# EAGLE design Electronical_dice (EAGLE 9.6.2)
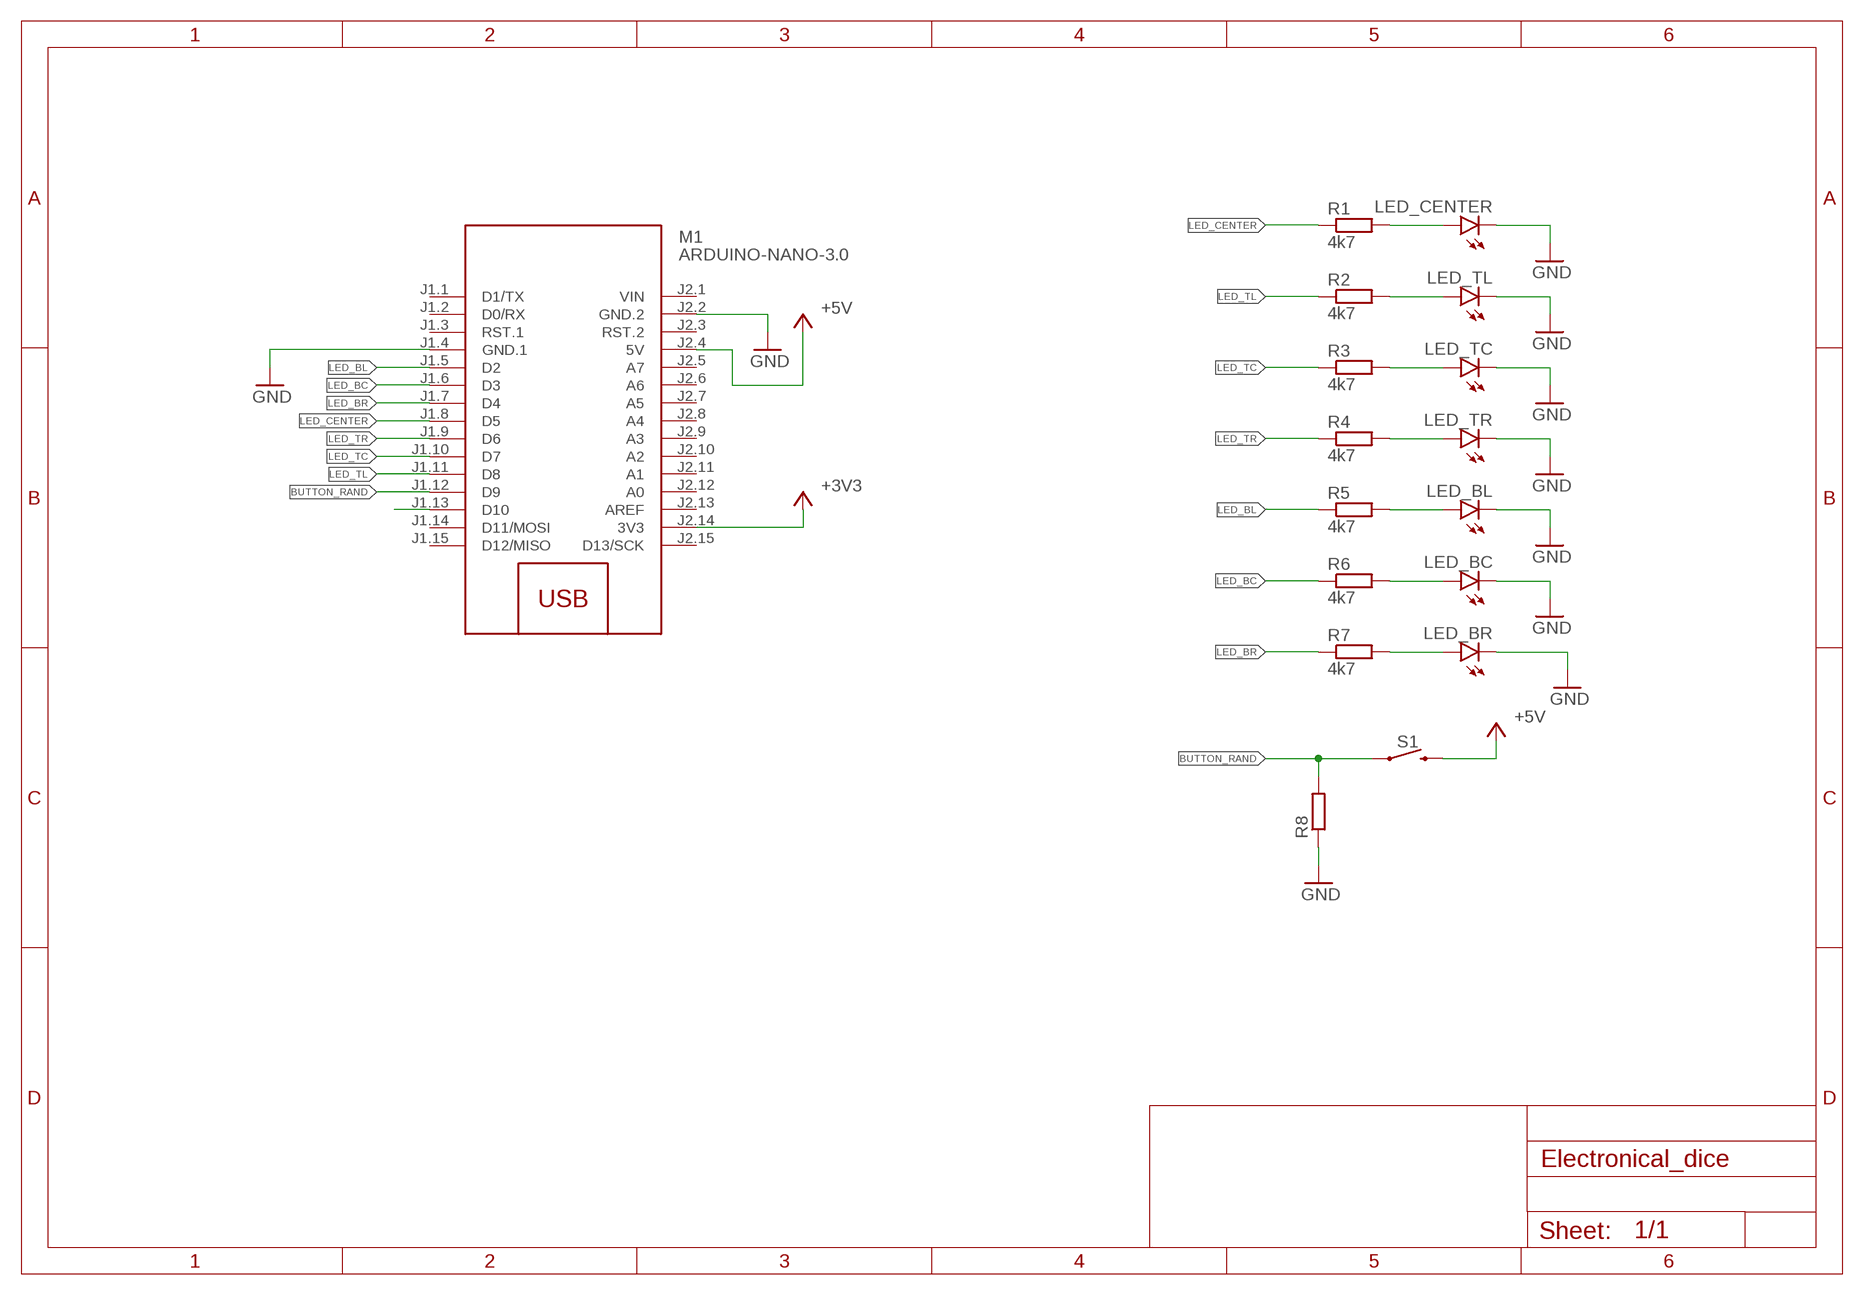
[diagram p0: schematic, sheet 1]

## Parts
LED_BC  LED_RADIAL_RED  [LEDRD254W60D565H860B]
LED_BL  LED_RADIAL_RED  [LEDRD254W60D565H860B]
LED_BR  LED_RADIAL_RED  [LEDRD254W60D565H860B]
LED_CENTER  LED_RADIAL_RED  [LEDRD254W60D565H860B]
LED_TC  LED_RADIAL_RED  [LEDRD254W60D565H860B]
LED_TL  LED_RADIAL_RED  [LEDRD254W60D565H860B]
LED_TR  LED_RADIAL_RED  [LEDRD254W60D565H860B]
M1  ARDUINO-NANO-3.0  [ARDUINO-NANO-3.0]
R1  4k7  R-EU_0207/7  [0207/7]
R2  4k7  R-EU_0207/7  [0207/7]
R3  4k7  R-EU_0207/7  [0207/7]
R4  4k7  R-EU_0207/7  [0207/7]
R5  4k7  R-EU_0207/7  [0207/7]
R6  4k7  R-EU_0207/7  [0207/7]
R7  4k7  R-EU_0207/7  [0207/7]
R8  R-EU_0207/7  [0207/7]
S1  MOMENTARY-SWITCH-SPST-PTH-6.0MM  [TACTILE_SWITCH_PTH_6.0MM]

## Nets
+3V3: M1.J2.14(3V3)
+5V: M1.J2.4(5V) S1.3
BUTTON_RAND: M1.J1.12(D9) R8.2 S1.1
GND: LED_BC.2(C) LED_BL.2(C) LED_BR.2(C) LED_CENTER.2(C) LED_TC.2(C) LED_TL.2(C) LED_TR.2(C) M1.J1.4(GND.1) M1.J2.2(GND.2) R8.1
LED_BC: M1.J1.6(D3) R6.1
LED_BL: M1.J1.5(D2) R5.1
LED_BR: M1.J1.7(D4) R7.1
LED_CENTER: M1.J1.8(D5) R1.1
LED_TC: M1.J1.10(D7) R3.1
LED_TL: M1.J1.11(D8) R2.1
LED_TR: M1.J1.9(D6) R4.1
N$1: LED_CENTER.1(A) R1.2
N$2: LED_TL.1(A) R2.2
N$3: LED_TC.1(A) R3.2
N$4: LED_TR.1(A) R4.2
N$5: LED_BL.1(A) R5.2
N$6: LED_BC.1(A) R6.2
N$7: LED_BR.1(A) R7.2
N$9: M1.J1.13(D10)
Unconnected: M1.J1.1(D1/TX) M1.J1.2(D0/RX) M1.J1.3(RST.1) M1.J1.14(D11/MOSI) M1.J1.15(D12/MISO) M1.J2.3(RST.2) M1.J2.5(A7) M1.J2.6(A6) M1.J2.7(A5) M1.J2.8(A4) M1.J2.9(A3) M1.J2.10(A2) M1.J2.11(A1) M1.J2.12(A0) M1.J2.13(AREF) M1.J2.15(D13/SCK)

## Power pins joined to a net without a drawn wire
VIN: M1.J2.1(VIN)

## Library data of the parts
LED_BC LED_BL LED_BR LED_CENTER LED_TC LED_TL LED_TR = Opto-Electronic:LED_RADIAL: LED - Generic; CATEGORY: Opto-Electronic; SUB-CATEGORY: LED
M1 = diy-modules:ARDUINO-NANO-3.0: Arduino Nano 3.0 and compatible devices More details available here: https://www.arduino.cc/en/Main/ArduinoBoardNano Click here to find device on ebay.com <http://www.ebay.com/sch/arduino+nano>
R1-R8 = rcl:R-EU_: RESISTOR, European symbol; SPICEPREFIX: R
S1 = SparkFun-Switches:MOMENTARY-SWITCH-SPST: Momentary Switch (Pushbutton) - SPST Normally-open (NO) SPST momentary switches (buttons, pushbuttons). Variants PTH-12MM - 12mm square, through-hole Momentary Pushbutton Switch - 12mm Square <https://www.sparkfun.com/products/9190> (COM-09190) PTH-6.0MM, PTH-6.0MM-KIT - 6.0mm square, through-hole Mini Pushbutton Switch <https://www.sparkfun.com/products/97> (COM-00097) KIT package intended for soldering kit's - only one side of pads' copper is exposed. PTH-RIGHT-ANGLE-KIT - Right-angle, through-hole Right Angle Tactile Button <https://www.sparkfun.com/products/10791> - Used on SparkFun BigTime Watch Kit <https://www.sparkfun.com/products/11734> SMD-12MM - 12mm square, surface-mount Tactile Button - SMD (12mm) <https://www.sparkfun.com/products/12993> (COM-12993) Used on SparkFun PicoBoard <https://www.sparkfun.com/products/11888> SMD-4.5MM - 4.5mm Square Trackball Switch Used on SparkFun Blackberry Trackballer Breakout <https://www.sparkfun.com/products/13169> SMD-4.6MMX2.8MM - 4.60mm x 2.80mm, surface mount Used on SparkFun SAMD21 Mini Breakout <https://www.sparkfun.com/products/13664> SMD-5.2MM, SMD-5.2-REDUNDANT - 5.2mm square, surface-mount Mini Pushbutton Switch - SMD <https://www.sparkfun.com/products/8720> (COM-08720) Used on Arduino Pro Mini <https://www.sparkfun.com/products/11114> REDUNDANT package connects both switch circuits together SMD-6.0X3.5MM - 6.0 x 3.5mm, surface mount Momentary Reset Switch SMD <https://www.sparkfun.com/products/8229> (COM-08229) SMD-6.2MM-TALL - 6.2mm square, surface mount Tactile Button - SMD (6mm) <https://www.sparkfun.com/products/12992> Used on SparkFun Digital Sandbox <https://www.sparkfun.com/products/12651> SMD-RIGHT-ANGLE - Right-angle, surface mount Used on SparkFun Block for Intel® Edison - Arduino <https://www.sparkfun.com/products/13036>; PROD_ID: SWCH-08441; SF_SKU: COM-00097

## Board
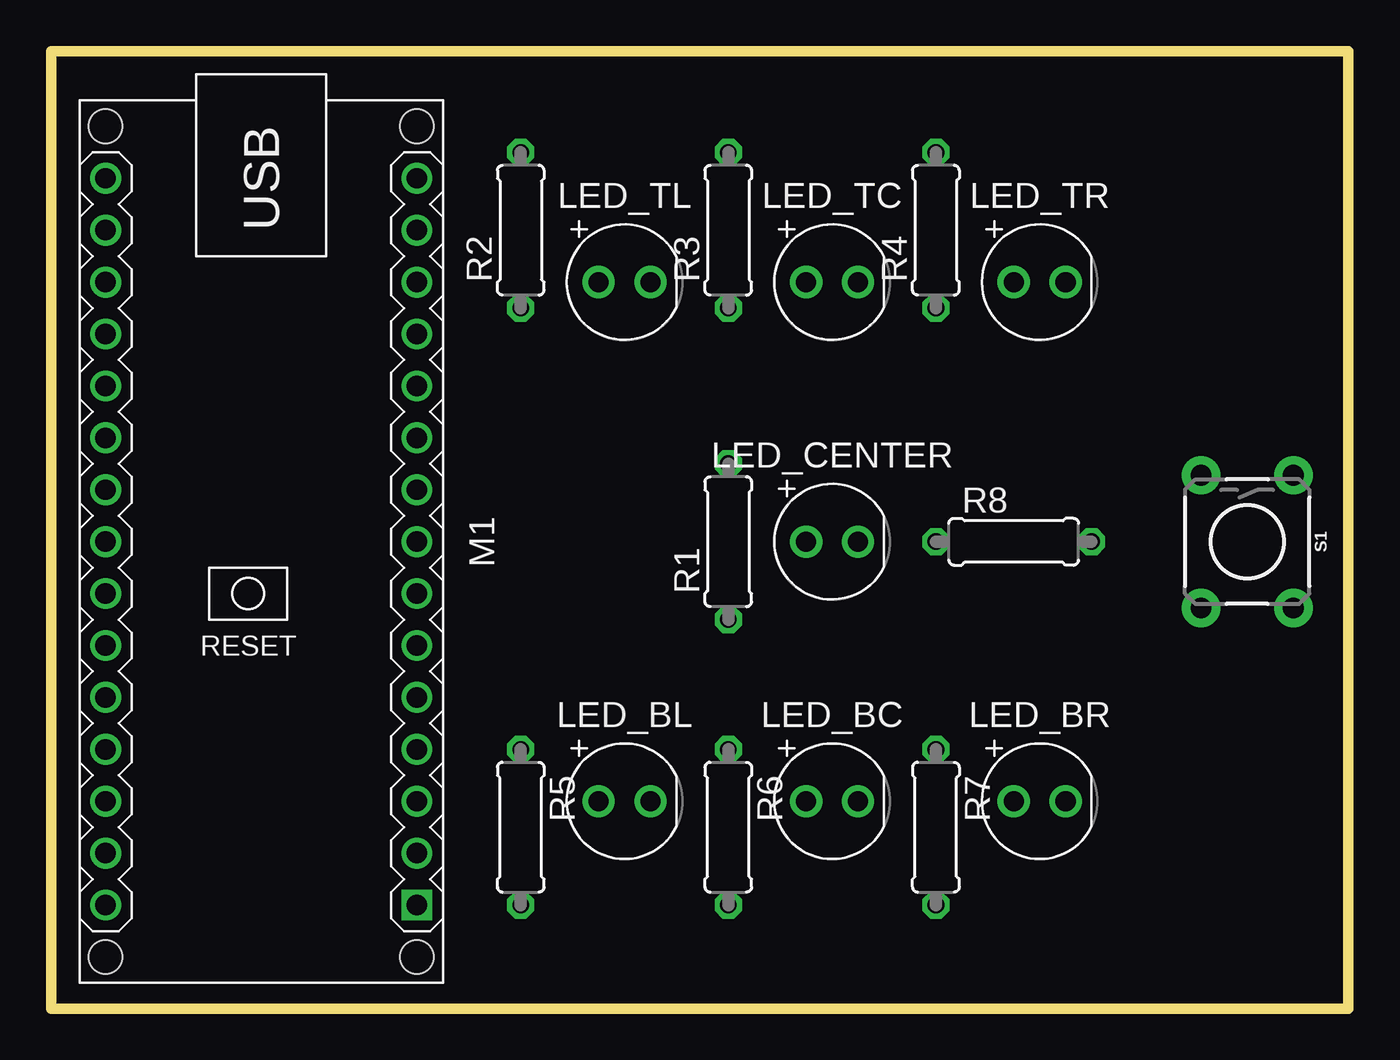
[diagram p1: board, top side]
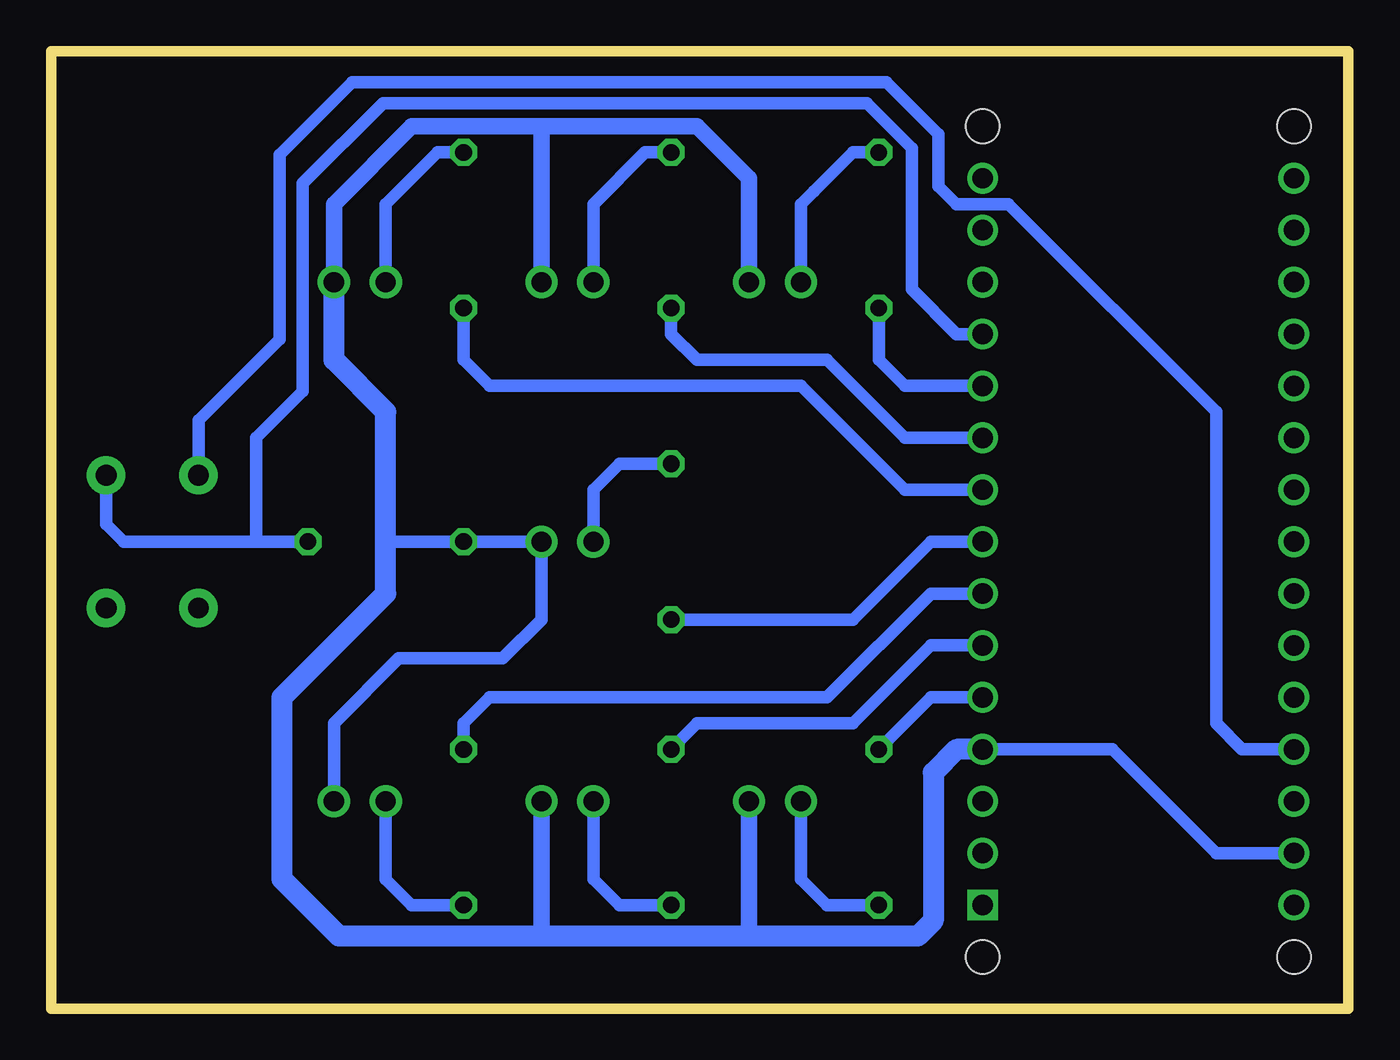
[diagram p2: board, bottom side, seen from below]

Size 63.5 x 46.86 mm. Coordinates in mm from the lower left corner, seen from the top.
Outline: 0,0 63.5,0 63.5,46.86 0,46.86 0,0
Copper layers (1*16): Top 0.035mm / dielectric 1.5mm / Bottom 0.035mm
Design rules "default *": minimum track width 6mil, minimum drill 0.35mm, track to track 6mil, track to pad 6mil, pad to pad 6mil, via to via 6mil, smd to smd 6mil, copper to edge 40mil, drill to drill 6mil, minimum pad ring 10mil, minimum via ring 8mil, stop-mask expansion 4mil, vias tented up to drill 0mil, thermal gap 10mil

### Footprints (pad centres in the part's own frame; a part is rotated, then mirrored left to right if it is on the bottom)
LEDRD254W60D565H860B = drill 0.981 pad 1.581: 1 -1.27,0; 2 1.27,0
ARDUINO-NANO-3.0 = drill 1 square: J1.1 17.78,7.62 | drill 1: J1.2 15.24,7.62; J1.3 12.7,7.62; J1.4 10.16,7.62; J1.5 7.62,7.62; J1.6 5.08,7.62; J1.7 2.54,7.62; J1.8 0,7.62; J1.9 -2.54,7.62; J1.10 -5.08,7.62; J1.11 -7.62,7.62; J1.12 -10.16,7.62; J1.13 -12.7,7.62; J1.14 -15.24,7.62; J1.15 -17.78,7.62; J2.1 17.78,-7.62; J2.2 15.24,-7.62; J2.3 12.7,-7.62; J2.4 10.16,-7.62; J2.5 7.62,-7.62; J2.6 5.08,-7.62; J2.7 2.54,-7.62; J2.8 0,-7.62; J2.9 -2.54,-7.62; J2.10 -5.08,-7.62; J2.11 -7.62,-7.62; J2.12 -10.16,-7.62; J2.13 -12.7,-7.62; J2.14 -15.24,-7.62; J2.15 -17.78,-7.62 | hole 1.651: -20.32,7.62; -20.32,-7.62; 20.32,-7.62; 20.32,7.62
0207/7 = drill 0.813 octagon: 1 -3.81,0; 2 3.81,0
TACTILE_SWITCH_PTH_6.0MM = drill 1.016 pad 1.88: 1 -3.251,2.261; 2 3.251,2.261; 3 -3.251,-2.261; 4 3.251,-2.261

### Placement (x,y rotation side)
LED_BC  38.23,10.16 0 top
LED_BL  28.07,10.16 0 top
LED_BR  48.39,10.16 0 top
LED_CENTER  38.23,22.86 0 top
LED_TC  38.23,35.56 0 top
LED_TL  28.07,35.56 0 top
LED_TR  48.39,35.56 0 top
M1  10.29,22.86 270 top
R1  33.15,22.86 90 top
R2  22.99,38.1 90 top
R3  33.15,38.1 90 top
R4  43.31,38.1 90 top
R5  22.99,8.89 270 top
R6  33.15,8.89 270 top
R7  43.31,8.89 270 top
R8  47.12,22.86 0 top
S1  58.55,22.86 270 top

### Tracks (layer width: path | path; a pad name or v marks a point on that pad's centre or on a via)
+5V
  Bottom 0.61: S1.3 56.29,28.8 52.32,32.77 52.32,41.78 48.77,45.34 22.61,45.34 20.07,42.8 20.07,40.26 19.18,39.37 16.64,39.37 6.48,29.21 6.48,13.97 5.21,12.7 M1.J2.4
BUTTON_RAND
  Bottom 0.61: S1.1 60.81,23.72 59.94,22.86 53.47,22.86 | 53.47,22.86 R8.2 | M1.J1.12 19.18,33.02 21.36,35.2 21.36,42.12 23.56,44.32 47.24,44.32 51.18,40.39 51.18,30.23 53.47,27.94 53.47,22.86
GND
  Bottom 0.61: M1.J2.2 6.48,7.62 11.56,12.7 M1.J1.4 | LED_BR.2 49.66,13.97 46.48,17.14 41.4,17.14 39.5,19.05 LED_CENTER.2 R8.1 47.12,22.86
  Bottom 0.813: LED_TR.2 49.66,39.37 45.85,43.18 39.5,43.18 | LED_TL.2 29.34,40.64 31.88,43.18 39.5,43.18 | LED_TC.2 39.5,43.18 | LED_BC.2 39.5,3.56 | LED_BL.2 29.34,3.56
  Bottom 1.016: M1.J1.4 19.18,12.7 20.32,11.56 20.32,4.32 21.08,3.56 29.34,3.56 39.5,3.56 | 38.86,3.56 49.4,3.56 52.2,6.35 52.2,15.24 47.12,20.32 47.12,22.86 47.12,29.21 49.66,31.75 LED_TR.2
LED_BC
  Bottom 0.61: M1.J1.6 20.45,17.78 24.26,13.97 31.88,13.97 R6.1
LED_BL
  Bottom 0.61: M1.J1.5 20.45,15.24 R5.1
LED_BR
  Bottom 0.61: M1.J1.7 20.45,20.32 25.53,15.24 42.04,15.24 43.31,13.97 R7.1
LED_CENTER
  Bottom 0.61: M1.J1.8 20.45,22.86 24.26,19.05 R1.1
LED_TC
  Bottom 0.61: M1.J1.10 21.72,27.94 25.53,31.75 31.88,31.75 33.15,33.02 R3.1
LED_TL
  Bottom 0.61: R2.1 22.99,31.75 21.72,30.48 M1.J1.11
LED_TR
  Bottom 0.61: M1.J1.9 21.72,25.4 26.8,30.48 42.04,30.48 43.31,31.75 R4.1
N$1
  Bottom 0.61: R1.2 35.69,26.67 36.96,25.4 LED_CENTER.1
N$2
  Bottom 0.61: R2.2 24.26,41.91 26.16,40.01 26.8,39.37 LED_TL.1
N$3
  Bottom 0.61: R3.2 34.42,41.91 36.96,39.37 LED_TC.1
N$4
  Bottom 0.61: R4.2 44.58,41.91 47.12,39.37 LED_TR.1
N$5
  Bottom 0.61: R5.2 25.53,5.08 26.8,6.35 LED_BL.1
N$6
  Bottom 0.61: R6.2 35.69,5.08 36.96,6.35 LED_BC.1
N$7
  Bottom 0.61: R7.2 45.85,5.08 47.12,6.35 LED_BR.1